# Altium schematic sheet BK1096_Power_Supply.SchDoc: =project_title
size Tabloid; PageSetup: Record=PageOptions|CenterHorizontal=True|CenterVertical=True|PrintScale=0.73|XCorrection=1.00|YCorrection=1.00|PrintKind=0|BorderSize=5000000|LeftOffset=0|BottomOffset=0|Orientation=2|PaperLength=1000|PaperWidth=1000|Scale=100|PaperSource=7|PrintQuality=-4|MediaType=1|DitherType=10|PaperKind=A4|PrintScaleMode=1; CompanyName: Luxonis Holding; Organization: Luxonis Holding; Address1: 1925 Harmony Park Drive; Address2: Westminster, CO; Address3: 80234; Address4: United States; SheetNumber: 5; SheetTotal: 6
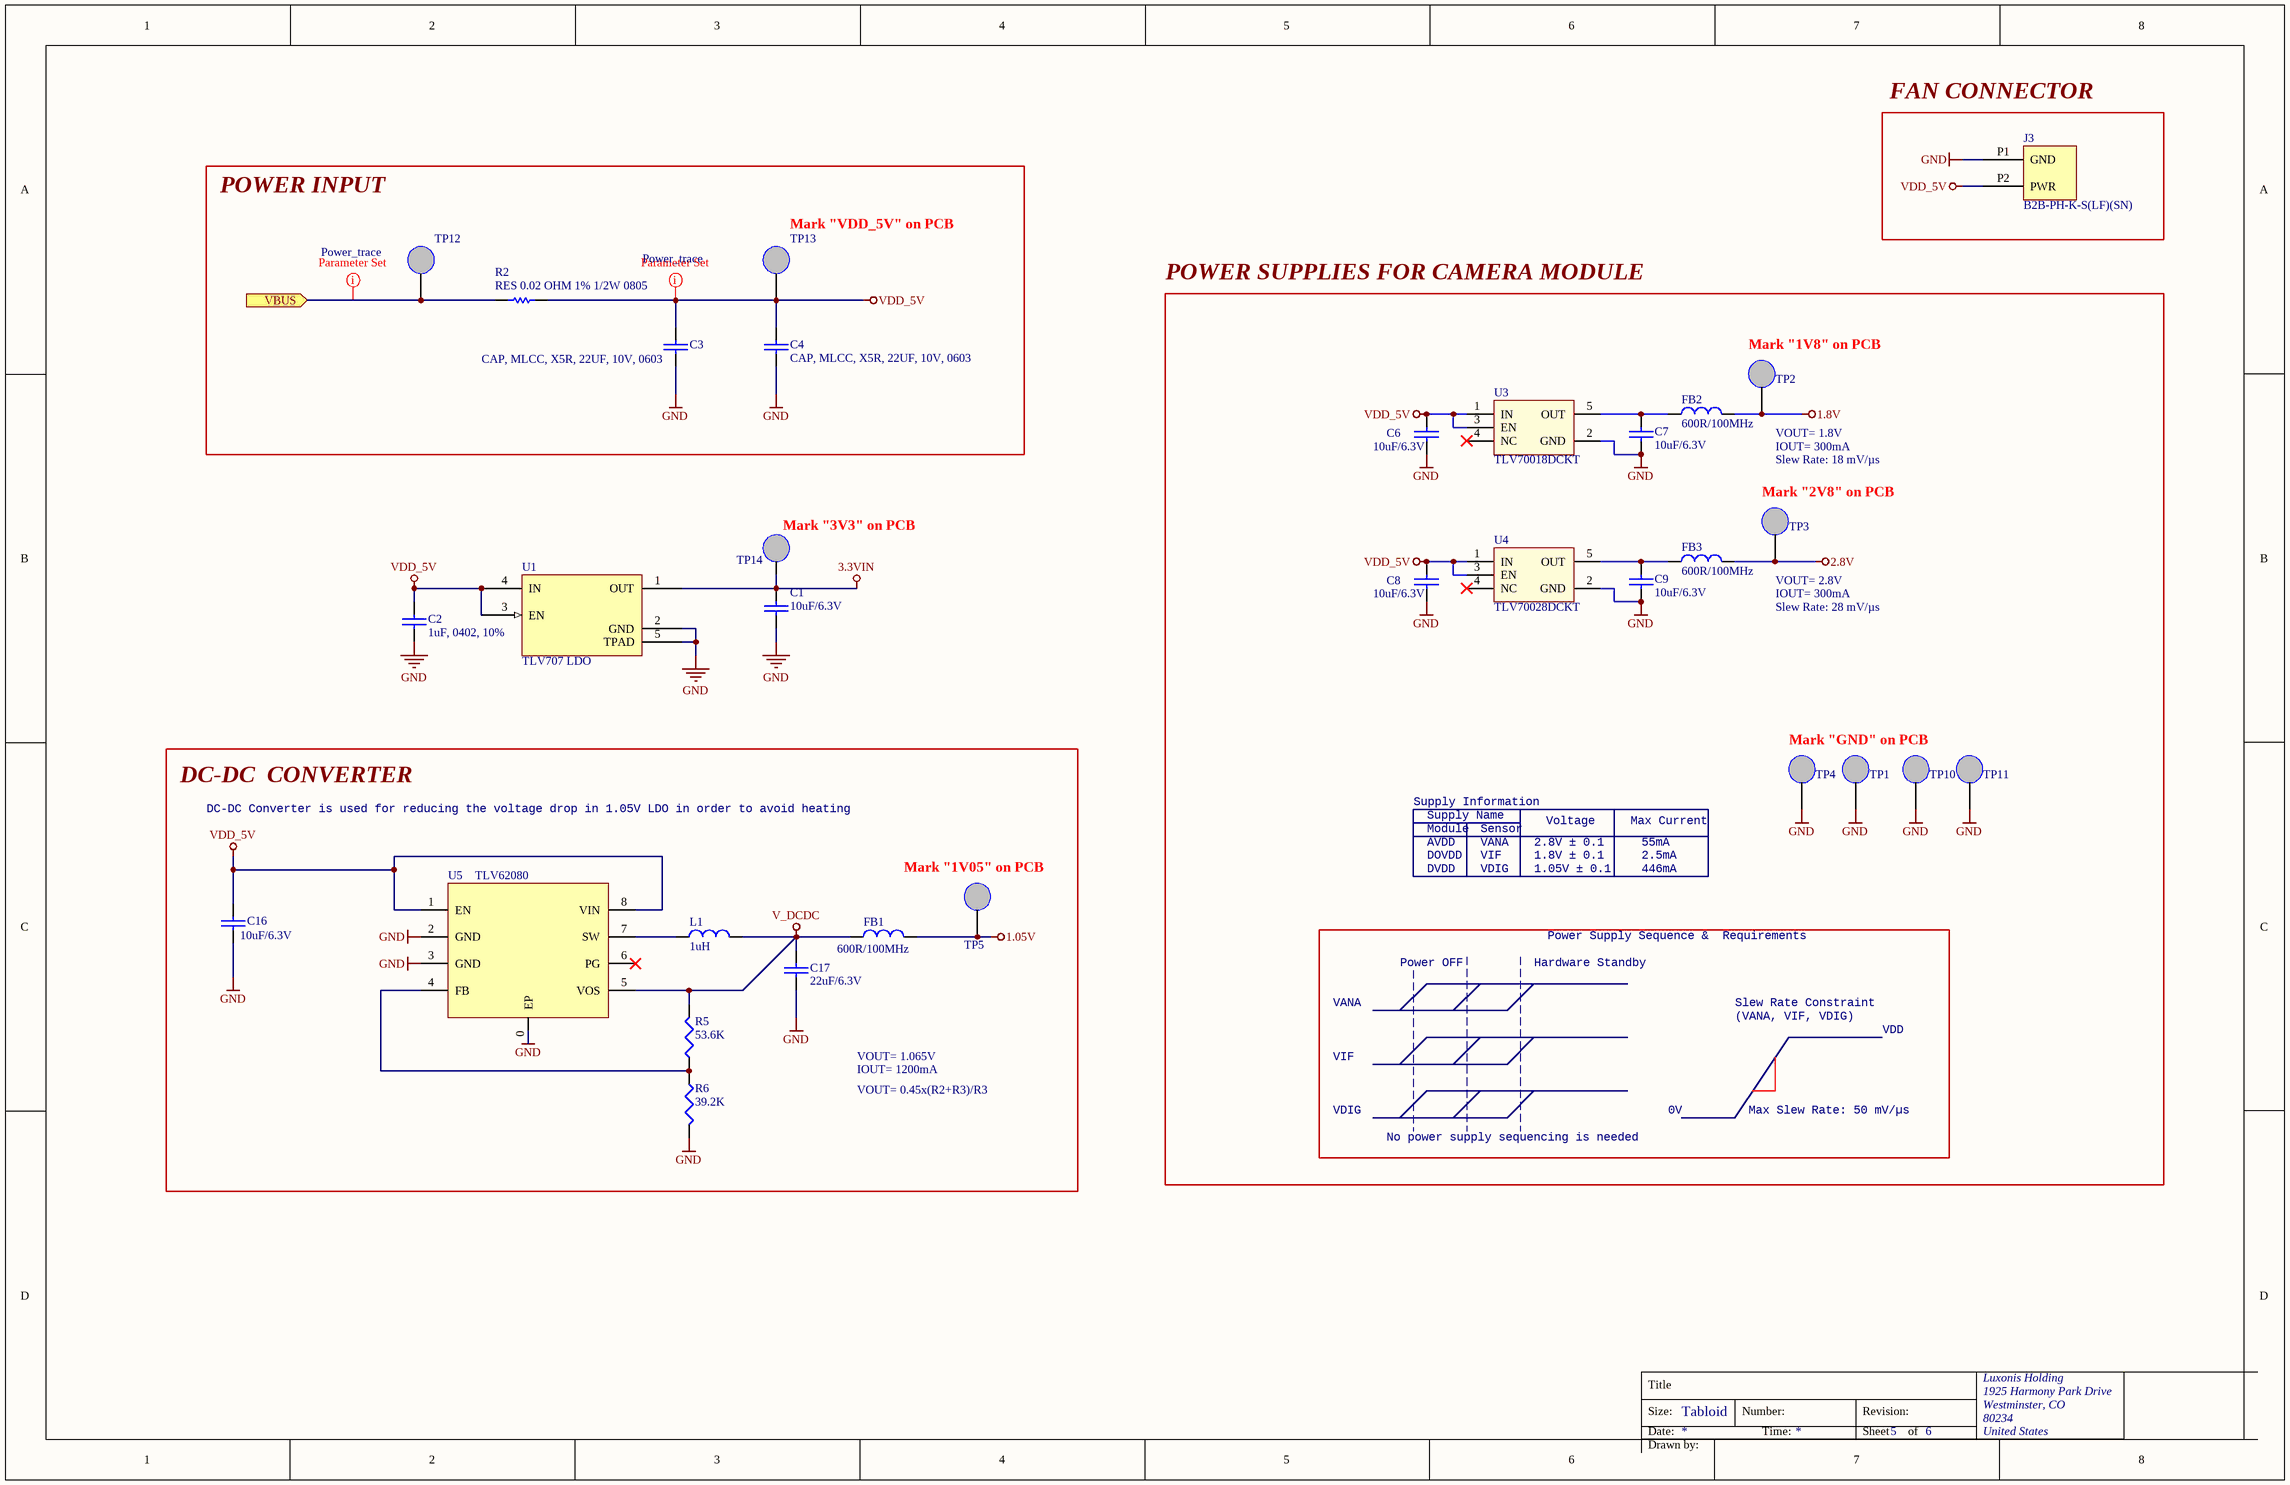
[diagram p0: BK1096_Power_Supply.SchDoc]

## Parts
C1  10uF/6.3V  [CAPC0402(1005)70_N]
C2  1uF, 0402, 10%  [CAPC0402(1005)70_N]
C3  CAP, MLCC, X5R, 22UF, 10V, 0603  [CAPC0603(1608)100_N]
C4  CAP, MLCC, X5R, 22UF, 10V, 0603  [CAPC0603(1608)100_N]
C6  10uF/6.3V  [0603]
C7  10uF/6.3V  [0603]
C8  10uF/6.3V  [0603]
C9  10uF/6.3V  [0603]
C16  10uF/6.3V  [0805]
C17  22uF/6.3V  [0805]
FB1  600R/100MHz  [0805]
FB2  600R/100MHz  [0805]
FB3  600R/100MHz  [0805]
J3  B2B-PH-K-S(LF)(SN)  [*JST_B2B-PH-K-S(LF)(SN)]
L1  1uH  [744029001]
R2  RES 0.02 OHM 1% 1/2W 0805  [RESC0805(2012)_N]
R5  53.6K  [0603]
R6  39.2K  [0603]
TP1  TP NM  [TP_SMD]  (value not drawn)  (no BOM)
TP2  TP NM  [TP_SMD]  (value not drawn)  (no BOM)
TP3  TP NM  [TP_SMD]  (value not drawn)  (no BOM)
TP4  TP NM  [TP_SMD]  (value not drawn)  (no BOM)
TP5  TP NM  [TP_SMD]  (value not drawn)  (no BOM)
TP10  TP NM  [TP_SMD]  (value not drawn)  (no BOM)
TP11  TP NM  [TP_SMD]  (value not drawn)  (no BOM)
TP12  TP NM  [TP_SMD]  (value not drawn)  (no BOM)
TP13  TP NM  [TP_SMD]  (value not drawn)  (no BOM)
TP14  TP NM  [TP_SMD]  (value not drawn)  (no BOM)
U1  TLV707 LDO  [DFN65P100X40-4L]
U3  TLV70018DCKT  [SC70-5]
U4  TLV70028DCKT  [SC70-5]
U5  TLV62080  [WSON-8]

## Blocks framed on the sheet
FAN CONNECTOR: J3
POWER INPUT: C3 C4 R2 TP12 TP13
POWER SUPPLIES FOR CAMERA MODULE: C6-C9 FB2 FB3 TP1-TP4 TP10 TP11 U3 U4
DC-DC  CONVERTER: C16 C17 FB1 L1 R5 R6 TP5 U5

## Ports
VBUS (in)

## Nets
1.05V: FB1.2 TP5.1
1.8V: FB2.2 TP2.1
2.8V: FB3.2 TP3.1
3.3VIN: C1.2 TP14.1 U1.1(OUT)
GND: C1.1 C2.2 C3.2 C4.2 C6.2 C7.2 C8.2 C9.2 C16.2 C17.2 J3.P1(GND) R6.2 TP1.1 TP4.1 TP10.1 TP11.1 U1.2(GND) U1.5(TPAD) U3.2(GND) U4.2(GND) U5.0(EP) U5.2(GND) U5.3(GND)
V_DCDC: C17.1 FB1.1 L1.1 R5.2 U5.5(VOS)
VDD_5V: C2.1 C3.1 C4.1 C6.1 C8.1 C16.1 J3.P2(PWR) R2.1 TP13.1 U1.3(EN) U1.4(IN) U3.1(IN) U3.3(EN) U4.1(IN) U4.3(EN) U5.1(EN) U5.8(VIN)
VBUS: R2.2 TP12.1 ; port VBUS
NetC7_1: C7.1 FB2.1 U3.5(OUT)
NetC9_1: C9.1 FB3.1 U4.5(OUT)
NetL1_2: L1.2 U5.7(SW)
NetR5_1: R5.1 R6.1 U5.4(FB)

Not connected (* = marked no-connect by the designer): U3 4(NC)*; U4 4(NC)*; U5 6(PG)*

## Layout directives
net class Power_trace: VBUS, VDD_5V

## Notes on the sheet
- (near TP13) Mark "VDD_5V" on PCB
- (near TP2) Mark "1V8" on PCB
- VOUT= 1.8V
- (near TP3) Mark "2V8" on PCB
- IOUT= 300mA
- Slew Rate: 18 mV/µs
- (near TP14) Mark "3V3" on PCB
- VOUT= 2.8V
- Slew Rate: 28 mV/µs
- Mark "GND" on PCB
- DC-DC Converter is used for reducing the voltage drop in 1.05V LDO in order to avoid heating
- Supply Information
- Supply Name
- Module
- Sensor
- Voltage
- Max Current
- (near TP5) Mark "1V05" on PCB
- AVDD
- DOVDD
- DVDD
- VANA
- VIF
- VDIG
- 2.8V ± 0.1
- 1.8V ± 0.1
- 1.05V ± 0.1
- 55mA
- 2.5mA
- 446mA
- Power OFF
- Hardware Standby
- Power Supply Sequence &  Requirements
- Slew Rate Constraint
- (VANA, VIF, VDIG)
- VDD
- VOUT= 1.065V
- IOUT= 1200mA
- VOUT= 0.45x(R2+R3)/R3
- No power supply sequencing is needed
- 0V
- Max Slew Rate: 50 mV/µs
- Title
- Size:
- Date:
- Tabloid
- Number:
- Time:
- Revision:
- Sheet
- of
- Drawn by:

## Library data of the parts
C1 = CAP: SMD Multilayer Ceramic Capacitor, 0402 [1005 Metric], 10 µF, 6.3 V, ± 20%, X5R; E - MFG: MuRata; F - MFG P/N: GRM155R60J106ME44D; D - my Footprint: CAPC0402(1005)70_N
C2 = CL05A105KP5NNNC: Cap Ceramic 1uF 10V X5R 10% SMD 0402 85C Paper T/R; Manufacturer: Samsung; Supplier 1: Digi-Key; Manufacturer Part Number: CL05A105KP5NNNC; Stock 1: 13690251; Pricing 1: 1 = 0.10000, 10 = 0.04200, 100 = 0.01880, 500 = 0.01340, 1000 = 0.01053, 2500 = 0.00958, 5000 = 0.00881 (USD); RoHS: Yes; Mount: Surface Mount; Case/Package: 0402; Case Code (Metric): 1005; Case Code (Imperial): 0402; Material: Ceramic; Contact Plating: Tin; Min Operating Temperature: -55°C; Max Operating Temperature: 85°C; Capacitance: 1uF; Tolerance: 10%; Packaging: Tape and Reel; Voltage Rating: 10V; Dielectric: X5R; Package Quantity: 1; Length: 1mm; Height: 0.5mm; Width: 0.02inch; Thickness: 0.022inch; Depth: 0.5mm; Radiation Hardening: No; ComponentLink1URL: https://datasheet.ciiva.com/15195/getdatasheetpartid-358390-15195630.pdf?src-supplier=Verical; ComponentLink1Description: https://datasheet.ciiva.com/15195/getdatasheetpartid-358390-15195630.pdf?src-supplier=Verical; ComponentLink2URL: https://datasheet.ciiva.com/29198/459159-da-01-en-vs-kondensator-0402-29198341.pdf?src-supplier=Conrad; ComponentLink2Description: https://datasheet.ciiva.com/29198/459159-da-01-en-vs-kondensator-0402-29198341.pdf?src-supplier=Conrad
C3 C4 = GRM188R61A226ME15D: Manufacturer 1: *
C6-C9 = CAP: SMD Multilayer Ceramic Capacitor, 0603 [1608 Metric], 10 µF, 6.3 V, ± 20%, X5R; MAN: Yageo(PHYCOM); MAN PN: CC0603MRX5R5BB106; ICCO PN: MV122009; DIST: Farnell; DIST PN: 1458902
C16 = CAP: CERAMIC CAPACITOR, 10UF, 6.3V, X5R, 20%, 0805; MAN: TAIYO YUDEN; MAN PN: JMK212BJ106MG-T; ICCO PN: M1V10010; DIST PN: 2372273; DIST: Farnell
C17 = CAP: SMD Multilayer Ceramic Capacitor, 0805 [2012 Metric], 22 µF, 6.3 V, ± 10%, X5R; MAN: TAIYO YUDEN; MAN PN: JMK212BJ226KG-T; ICCO PN: MV122020; DIST PN: 2113069; DIST: Farnell
FB1-FB3 = INDUCTANCE1: Ferrite Bead, 600 ohm, 0805 [2012 Metric], 2 A, 0.1 ohm, ± 25%; MAN: FAIR-RITE; MAN PN: 2508056017Y2; ICCO PN: MV142024; DIST: Farnell; DIST PN: 1838838RL
J3 = B2B-PH-K-S(LF)(SN): CONN HEADER VERT 2POS 2MM; Manufacturer: JST; Number of Positions: 2; Connector Type: Male Pin; Current Rating: 2A; Gender: Male; Contact Resistance: 20mR; Insulation Resistance: 1MR; Voltage Rating: 100V; Supplier 1: Digi-Key; Manufacturer Part Number: B2B-PH-K-S(LF)(SN); Stock 1: 216199; Pricing 1: 1 = 0.170000, 10 = 0.162000, 100 = 0.100200, 500 = 0.082880, 1000 = 0.072520, 5000 = 0.062160, 10000 = 0.060440 (USD); RoHS: Yes; Mount: Through Hole; Number of Pins: 2; Contact Plating: Tin; Color: Natural; Contact Material: Brass; Housing Material: Polyamide; Housing Color: White; Min Operating Temperature: -25°C; Max Operating Temperature: 85°C; Number of Rows: 1; Packaging: Bulk; Termination: Solder; Fastening Type: Detent; Number of Poles: 2; Number of Contacts: 2; Orientation: Straight; Max Current Rating: 2A; Max Voltage Rating (AC): 100V; Voltage Rating (AC): 100V; Working Voltage: 100V; Max Voltage Rating (DC): 100V; Length: 5.9mm; Height: 9.4mm; Pitch: 2mm; Width: 4.5mm; Contact Mating Length: 0.13inch; Depth: 4.5mm; Lead Pitch: 2mm; Lead Free: Lead Free; REACH SVHC: No SVHC; ComponentLink1URL: https://datasheet.ciiva.com/6747/80560-6747392.pdf?src-supplier=Newark; ComponentLink1Description: https://datasheet.ciiva.com/6747/80560-6747392.pdf?src-supplier=Newark; ComponentLink2URL: https://datasheet.ciiva.com/11746/0900766b8082f551-11746676.pdf?src-supplier=RSComponents; ComponentLink2Description: https://datasheet.ciiva.com/11746/0900766b8082f551-11746676.pdf?src-supplier=RSComponents; ComponentLink3URL: https://datasheet.ciiva.com/8052/80560-8052022.pdf?src-supplier=Element14; ComponentLink3Description: https://datasheet.ciiva.com/8052/80560-8052022.pdf?src-supplier=Element14; ComponentLink4URL: https://datasheet.ciiva.com/712/eph-712442.pdf?src-supplier=Digi-Key; ComponentLink4Description: https://datasheet.ciiva.com/712/eph-712442.pdf?src-supplier=Digi-Key; ComponentLink5URL: https://datasheet.ciiva.com/16422/b2b-ph-k-slfsn-16422715.pdf?src-supplier=Future+Electronics; ComponentLink5Description: https://datasheet.ciiva.com/16422/b2b-ph-k-slfsn-16422715.pdf?src-supplier=Future+Electronics; Supplier Part Number 1: 455-1704-ND
L1 = INDUCTANCE1_1: FIXED IND 1UH 2.2A 55 MOHM SMD; MAN: Wurth; ICCO PN: MV249002; DIST: Farnell; DIST PN: 1635825; MAN PN: 744029001
R2 = D-100-0004
R5 = RES1: RES SMD 53.6K OHM 1% 1/10W 0603; MAN PN: CR0603-FX-5362ELF; MAN: Bourns Inc.; DIST: Digi-Key; DIST PN: CR0603-FX-5362ELFCT-ND
R6 = RES1: SMD Chip Resistor, Anti-Surge, 39.2 kohm, 150 V, 0603 [1608 Metric], 250 mW, ± 1%; MAN PN: ERJPA3F3922V; MAN: Panasonic; ICCO PN: MV249003; DIST: Farnell; DIST PN: 2562012RL
TP1-TP5 TP10-TP14 = TP: TEST POIN; MAN: SMD TESTPOINT; MAN PN: SMD TESTPOINT
U1 = TLV707: IC REG LDO 1V 0.2A 4X2SON; Manufacturer: Texas Instruments; Manufacturer Part Number: TLV70710DQNR; Output Current: 200mA; Number of Regulators: 1; Min Current Limit: 240mA; Quiescent Current: 25uA; Dropout Voltage: 250mV; Supplier 1: Digi-Key; Stock 1: 4380; Pricing 1: 1 = 0.46000, 10 = 0.37300, 100 = 0.25380, 500 = 0.19034, 1000 = 0.14276 (USD); RoHS: Yes; Mount: Surface Mount; Min Operating Temperature: -40°C; Max Operating Temperature: 125°C; Packaging: Tape and Reel; Package Quantity: 3000; Output Voltage: 1V; Lead Free: Lead Free; ComponentLink1URL: http://www.ti.com/lit/gpn/tlv707?src-supplier=Mouser; ComponentLink1Description: http://www.ti.com/lit/gpn/tlv707?src-supplier=Mouser; ComponentLink2URL: http://www.ti.com/lit/ds/symlink/tlv707.pdf?src-supplier=Digi-Key; ComponentLink2Description: http://www.ti.com/lit/ds/symlink/tlv707.pdf?src-supplier=Digi-Key
U3 = TLV70018DCKT: LDO, 200MA, 1.8V, 5SC70; MAN: TI; DIST PN: 1778221; DIST: Farnell; ICCO PN: MV198003; MAN PN: TLV70018DCKT
U4 = TLV70028DCKT: LDO, 200MA, 2.8V, 5SC70; MAN: TI; DIST PN: 1778222; DIST: Farnell; ICCO PN: MV200002; MAN PN: TLV70028DCKT
U5 = TLV62080: IC REG BUCK ADJ 1.2A SYNC 8WSON; ICCO PN: MV249006; MAN: TI; MAN PN: TLV62080DSGT; DIST: Mouser; DIST PN: 595-TLV62080DSGT